# EAGLE design Smartenit_Board (EAGLE 8.6.0)
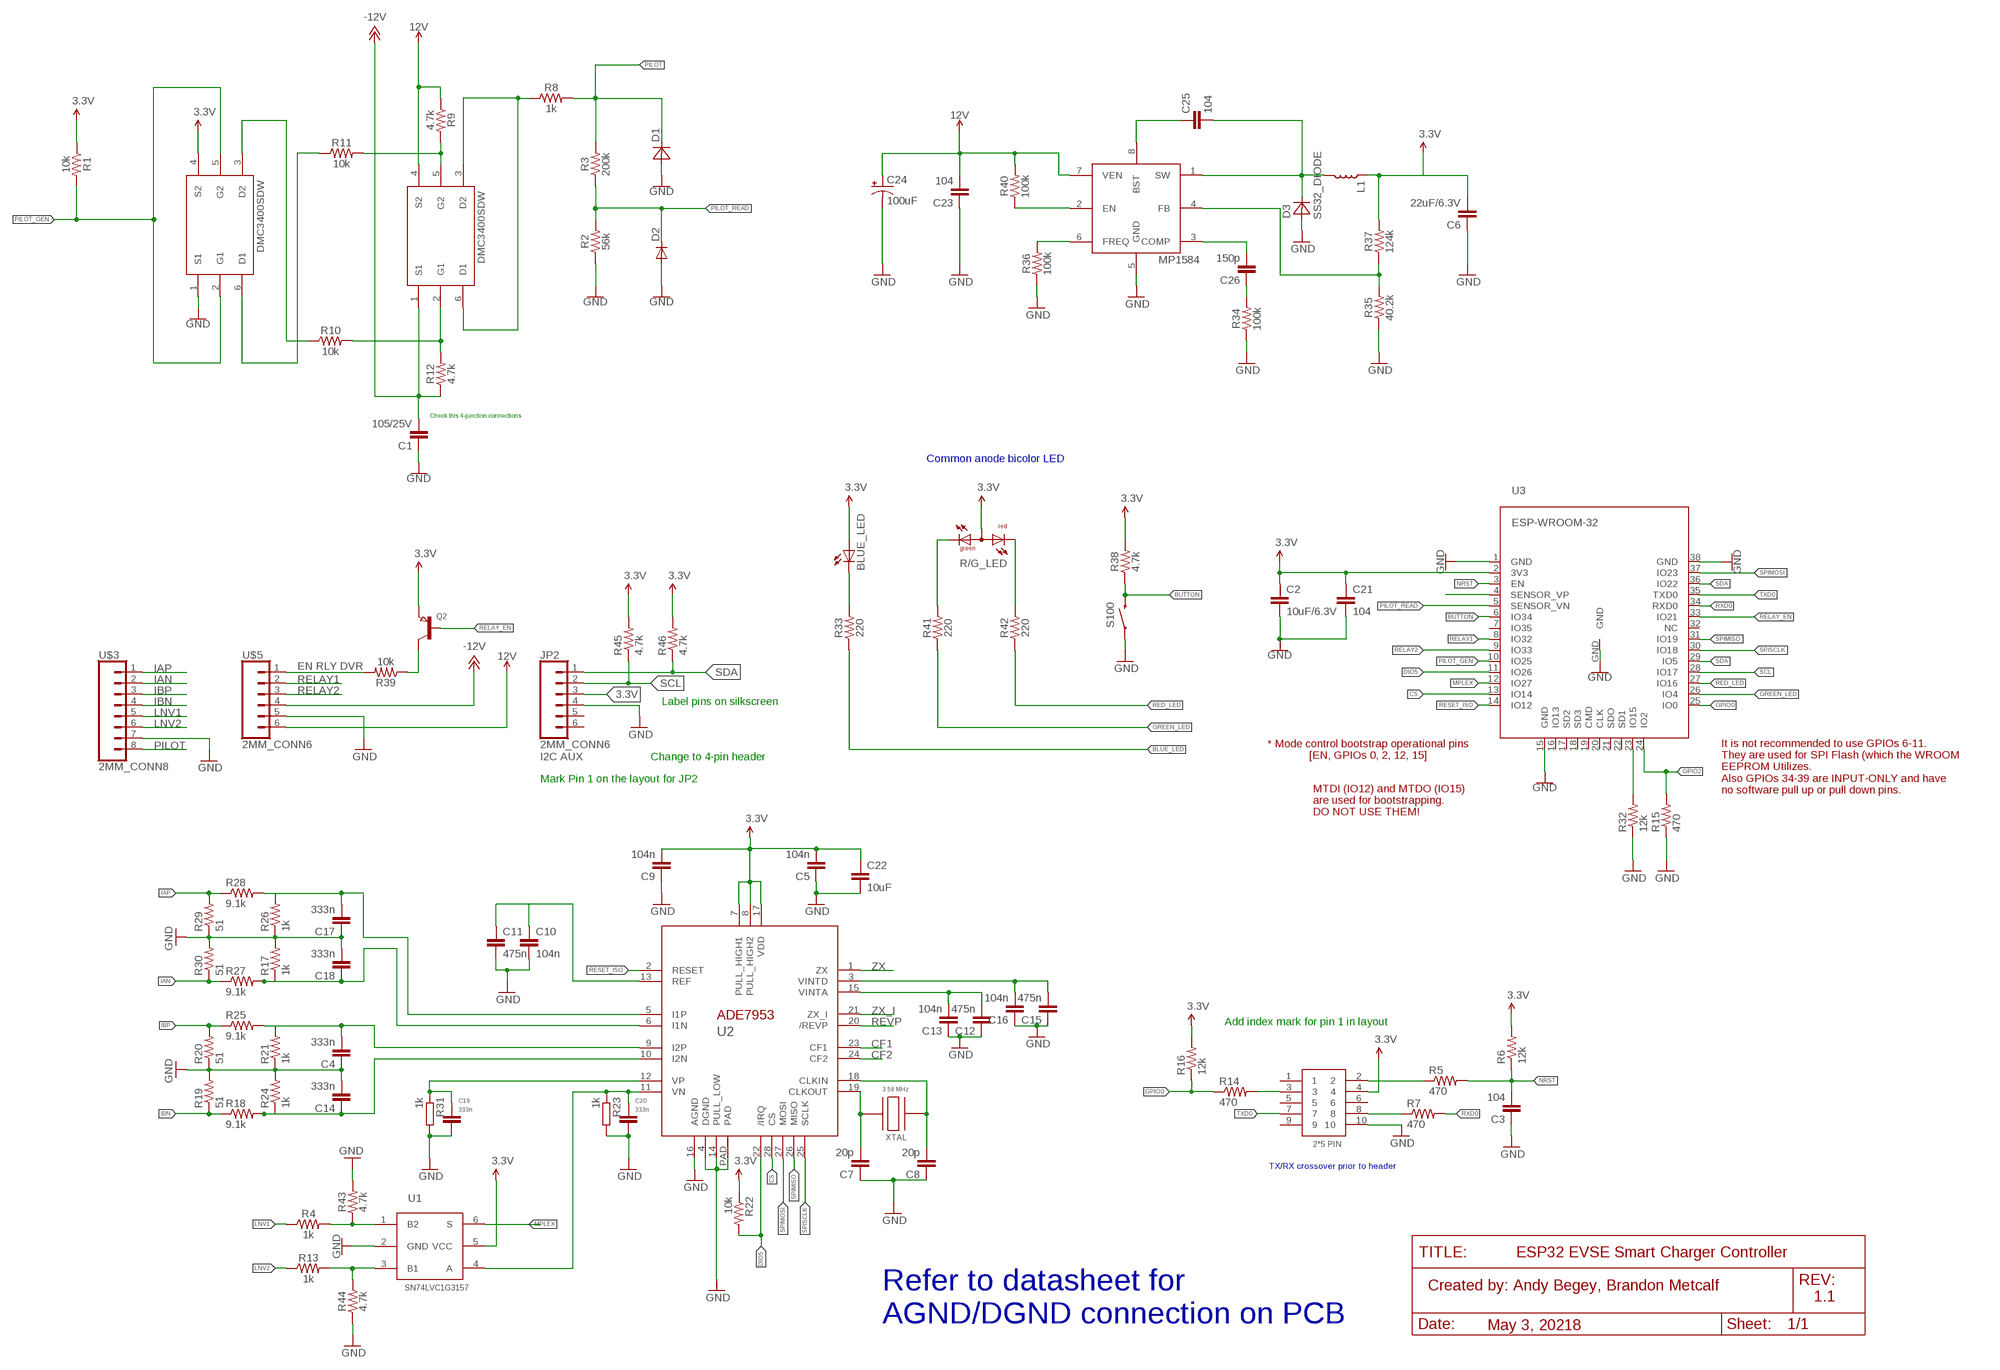
[diagram p0: schematic, sheet 1]

## Parts
BLUE_LED  LED3MM  [LED3MM]
C1  105/25V  680PF-0603-50V-10%  [0603]
C2  10uF/6.3V  CAP0805  [0805]
C3  104  0402-CAP  [0402-CAP]
C4  333n  0402-CAP  [0402-CAP]
C5  104n  0402-CAP  [0402-CAP]
C6  22uF/6.3V  680PF-0603-50V-10%  [0603]
C7  20p  0402-CAP  [0402-CAP]
C8  20p  0402-CAP  [0402-CAP]
C9  104n  0402-CAP  [0402-CAP]
C10  104n  0402-CAP  [0402-CAP]
C11  475n  0402-CAP  [0402-CAP]
C12  475n  0402-CAP  [0402-CAP]
C13  104n  0402-CAP  [0402-CAP]
C14  333n  0402-CAP  [0402-CAP]
C15  475n  0402-CAP  [0402-CAP]
C16  104n  0402-CAP  [0402-CAP]
C17  333n  0402-CAP  [0402-CAP]
C18  333n  0402-CAP  [0402-CAP]
C19  333n  C-EUC0805K  [C0805K]
C20  333n  C-EUC0805K  [C0805K]
C21  104  CAP0603-CAP  [0603-CAP]
C22  10uF  10UF-0805-10V-10%  [0805]
C23  104  680PF-0603-50V-10%  [0603]
C24  100uF  CAP_POLPTH1  [CPOL-RADIAL-100UF-25V]
C25  104  680PF-0603-50V-10%  [0603]
C26  150p  680PF-0603-50V-10%  [0603]
D1  P6SMB16A  TVSDIODE  [D014AC]
D2  DIODESOD  [SOD-323]
D3  SS32_DIODE  [D0-214AB]
J1  2X5CONNECTOR1.27MM  [1296-10]
JP2  2MM_CONN6  [CONN6_2MM]
L1  47µH/±30%/750mA  INDUCTOR-CR54-47UH  [CR54]
Q2  PNP-TRANSISTOR_SOT23  [SOT23]
R1  10k  100KOHM-0603-1/10W-1%  [0603]
R2  56k  100KOHM-0603-1/10W-1%  [0603]
R3  200k  100KOHM-0603-1/10W-1%  [0603]
R4  1k  1KOHM-0603-1/10W-1%  [0603]
R5  470  0402-RES  [0402-RES]
R6  12k  0402-RES  [0402-RES]
R7  470  0402-RES  [0402-RES]
R8  1k  100KOHM-0603-1/10W-1%  [0603]
R9  4.7k  100KOHM-0603-1/10W-1%  [0603]
R10  10k  100KOHM-0603-1/10W-1%  [0603]
R11  10k  100KOHM-0603-1/10W-1%  [0603]
R12  4.7k  100KOHM-0603-1/10W-1%  [0603]
R13  1k  1KOHM-0603-1/10W-1%  [0603]
R14  470  0402-RES  [0402-RES]
R15  470  0402-RES  [0402-RES]
R16  12k  0402-RES  [0402-RES]
R17  1k  0402-RES  [0402-RES]
R18  9.1k  0402-RES  [0402-RES]
R19  51  0402-RES  [0402-RES]
R20  51  0402-RES  [0402-RES]
R21  1k  0402-RES  [0402-RES]
R22  10k  0402-RES  [0402-RES]
R23  1k  R-EU_  [C0805K@1]
R24  1k  0402-RES  [0402-RES]
R25  9.1k  0402-RES  [0402-RES]
R26  1k  0402-RES  [0402-RES]
R27  9.1k  0402-RES  [0402-RES]
R28  9.1k  0402-RES  [0402-RES]
R29  51  0402-RES  [0402-RES]
R30  51  0402-RES  [0402-RES]
R31  1k  R-EU_  [C0805K@1]
R32  12k  0402-RES  [0402-RES]
R33  220  10KOHM-0603-1/10W-1%  [0603]
R34  100k  100KOHM-0603-1/10W-1%  [0603]
R35  40.2k  100KOHM-0603-1/10W-1%  [0603]
R36  100k  100KOHM-0603-1/10W-1%  [0603]
R37  124k  100KOHM-0603-1/10W-1%  [0603]
R38  4.7k  10KOHM-0603-1/10W-1%  [0603]
R39  10k  100KOHM-0603-1/10W-1%  [0603]
R40  100k  100KOHM-0603-1/10W-1%  [0603]
R41  220  10KOHM-0603-1/10W-1%  [0603]
R42  220  10KOHM-0603-1/10W-1%  [0603]
R43  4.7k  1KOHM-0603-1/10W-1%  [0603]
R44  4.7k  1KOHM-0603-1/10W-1%  [0603]
R45  4.7k  0402-RES  [0402-RES]
R46  4.7k  0402-RES  [0402-RES]
R/G_LED  DUOLED-RG-A  [DUOLED-A-5MM]
S100  SWITCH-MOMENTARY-2PTH  [TACTILE-PTH]
U1  SN74LVC1G3157  [DBV-6]
U2  ADE7953  [28-WFQFN]
U3  ESP-WROOM-32  [ESP-WROOM-32]
U$1  DMC3400SSDW  [SOT363]
U$2  DMC3400SSDW  [SOT363]
U$3  2MM_CONN8  [CONN82MM]
U$4  MP1584  [SOIC8]
U$5  2MM_CONN6  [CONN6_2MM]
XTAL  QUARTZ_3.58M_2PIN  [HC-49S]

## Nets
3.3V: BLUE_LED.A C2.1 C5.2 C6.2 C9.2 C21.1 C22.1 J1.4 JP2.3(PIN3) L1.P$1 Q2.2(E) R1.1 R6.2 R16.2 R22.1 R37.2 R38.2 R45.2 R46.2 R/G_LED.A U1.5(VCC) U2.7(PULL_HIGH1) U2.8(PULL_HIGH2) U2.17(VDD) U3.2(3V3) U$1.4(S2)
12V: C23.2 C24.1(+) R9.1 R40.2 U$2.4(S2) U$4.7(VEN) U$5.6(PIN6)
-12V: C1.2 R12.1 U$2.1(S1) U$5.4(PIN4)
AGND: C4.1 C10.2 C11.2 C12.1 C13.1 C14.2 C17.1 C18.2 C19.2 C20.2 R17.2 R19.2 R20.1 R21.1 R23.2 R24.2 R26.1 R29.1 R30.2 R31.2 U1.2(GND) U2.16(AGND) U$3.7 ; supply symbol labelled GND
BLUE_LED: R33.1
BUTTON: R38.1 S100.3 U3.6(IO34)
CF1: U2.23(CF1)
CF2: U2.24(CF2)
CS: U2.28(CS) U3.13(IO14)
DGND: C1.1 C2.2 C3.1 C5.1 C6.1 C7.1 C8.1 C9.1 C15.1 C16.1 C21.2 C22.2 C23.1 C24.2(-) D1.P D2.2(A) J1.10 R2.1 R15.1 R32.1 R34.1 R35.1 R36.1 R43.2 R44.1 S100.1 U2.4(DGND) U2.14(PULL_LOW) U2.PAD U3.1(GND) U3.15(GND) U3.38(GND) U3.GND U$1.1(S1) U$4.5(GND) U$5.5(PIN5) ; supply symbol labelled GND
DIO5: R22.2 U2.22(/IRQ) U3.11(IO26)
FRGGN: R32.2 U3.23(IO15)
GND: D3.P JP2.4(PIN4)
GPIO0: R14.1 R16.1 U3.25(IO0)
GPIO2: R15.2 U3.24(IO2)
GREEN_LED: R41.1 U3.26(IO4)
IAN: R27.1 R30.1 U$3.2
IAP: R28.1 R29.2 U$3.1
IBN: R18.1 R19.1 U$3.4
IBP: R20.2 R25.1 U$3.3
LNV1: R4.1 U$3.5
LNV2: R13.1 U$3.6
MPLEX: U1.6(S) U3.12(IO27)
N$1: C7.2 U2.19(CLKOUT) XTAL.1
N$2: C8.2 U2.18(CLKIN) XTAL.2
N$3 [ic]: C20.1 R23.1 U1.4(A) U2.11(VN)
N$4: R36.2 U$4.6(FREQ)
N$5: C4.2 R21.2 R25.2 U2.9(I2P)
N$7: C10.1 C11.1 U2.13(REF)
N$8: C12.2 C13.2 U2.15(VINTA)
N$10: R4.2 R43.1 U1.1(B2)
N$11: C14.1 R18.2 R24.1 U2.10(I2N)
N$12: C15.2 C16.2 U2.3(VINTD)
N$13: R13.2 R44.2 U1.3(B1)
N$14: R40.1 U$4.2(EN)
N$15: C26.2 U$4.3(COMP)
N$17: C26.1 R34.2
N$18: C25.2 D3.N L1.P$2 U$4.1(SW)
N$19: R35.2 R37.1 U$4.4(FB)
N$20: Q2.3(C) R39.1
N$21: BLUE_LED.K(C) R33.2
N$22: C25.1 U$4.8(BST)
N$23: R9.2 R11.2 U$2.5(G2)
N$24: C17.2 R26.2 R28.2 U2.5(I1P)
N$25: R41.2 R/G_LED.CX(CG)
N$26: R42.2 R/G_LED.CR
N$27: C18.1 R17.1 R27.2 U2.6(I1N)
N$28: R10.1 U$1.3(D2)
N$29: R10.2 R12.2 U$2.2(G1)
N$32: R11.1 U$1.6(D1)
N$33: R8.1 U$2.3(D2) U$2.6(D1)
N$38: R39.2 U$5.1(PIN1)
N$40: J1.3 R14.2
N$47: U3.4(SENSOR_VP)
N$62: J1.2 R5.1
N$65: J1.8 R7.1
NRST: C3.2 R5.2 R6.1 U3.3(EN)
PILOT: D1.N R3.2 R8.2 U$3.8
PILOT_GEN: R1.2 U3.10(IO25) U$1.2(G1) U$1.5(G2)
PILOT_READ: D2.1(C) R2.2 R3.1 U3.5(SENSOR_VN)
RED_LED: R42.1 U3.27(IO16)
RELAY1: U3.8(IO32) U$5.2(PIN2)
RELAY2: U3.9(IO33) U$5.3(PIN3)
RELAY_EN: Q2.1(B) U3.33(IO21)
RESET_ISO: U2.2(RESET) U3.14(IO12)
REVP: U2.20(/REVP)
RXD0: R7.2 U3.34(RXD0)
SCL: JP2.2(PIN2) R45.1 U3.28(IO17)
SDA: JP2.1(PIN1) R46.1 U3.29(IO5) U3.36(IO22)
SPIMISO: U2.26(MISO) U3.31(IO19)
SPIMOSI: U2.27(MOSI) U3.37(IO23)
SPISCLK: U2.25(SCLK) U3.30(IO18)
TXD0: J1.7 U3.35(TXD0)
V2P [ic]: C19.1 R31.1 U2.12(VP)
ZX: U2.1(ZX)
ZX_I: U2.21(ZX_I)
Unconnected: J1.1 J1.5 J1.6 J1.9 JP2.5(PIN5) JP2.6(PIN6) U3.7(IO35) U3.16(IO13) U3.17(SD2) U3.18(SD3) U3.19(CMD) U3.20(CLK) U3.21(SDO) U3.22(SD1) U3.32(NC)

## Notes on the sheet
- Check this 4-junction connections
- Common anode bicolor LED
- Q2
- EN RLY DVR
- Label pins on silkscreen
- * Mode control bootstrap operational pins
  [EN, GPIOs 0, 2, 12, 15]
- I2C AUX | Change to 4-pin header
- Mark Pin 1 on the layout for JP2
- It is not recommended to use GPIOs 6-11.
  They are used for SPI Flash (which the WROOM
  EEPROM Utilizes.
  Also GPIOs 34-39 are INPUT-ONLY and have
  no software pull up or pull down pins.
- MTDI (IO12) and MTDO (IO15) 
  are used for bootstrapping. 
  DO NOT USE THEM!
- Add index mark for pin 1 in layout
- 3.58 MHz
- TX/RX crossover prior to header
- ESP32 EVSE Smart Charger Controller
- Created by: Andy Begey, Brandon Metcalf
- 1.1
- Refer to datasheet for 
  AGND/DGND connection on PCB
- May 3, 20218

## Library data of the parts
BLUE_LED = SparkFun:LED: LEDs Standard schematic elements and footprints for 5mm, 3mm, 1206, and 0603 sized LEDs. 5mm - Spark Fun Electronics SKU : COM-00529 (and others)
C1 C6 C23 C25 C26 = SparkFun-Capacitors:680PF: 680pF/0.68nF ceramic capacitors A capacitor is a passive two-terminal electrical component used to store electrical energy temporarily in an electric field.; PROD_ID: CAP-09232; VALUE: 680pF
C2 C21 = SparkFun:CAP: Capacitor Standard 0603 ceramic capacitor, and 0.1" leaded capacitor.
C3-C5 C7-C18 = Nizanlib:0402-CAP
C19 C20 = resistor:C-EU: CAPACITOR, European symbol
C22 = SparkFun-Capacitors:10UF: 10.0µF ceramic capacitors A capacitor is a passive two-terminal electrical component used to store electrical energy temporarily in an electric field.; PROD_ID: CAP-11330
C24 = SparkFun:CAP_POL: Capacitor Polarized These are standard SMD and PTH capacitors. Normally 10uF, 47uF, and 100uF in electrolytic and tantalum varieties. Always verify the external diameter of the through hole cap, it varies with capacity, voltage, and manufacturer. The EIA devices should be standard.
D1 = Smart_Charger:TVSDIODE
D2 = SparkFun:DIODE: Diode These are standard reverse protection diodes and small signal diodes. SMA package can handle up to about 1A. SOD-323 can handle about 200mA. What the SOD-323 package when ordering, there are some mfgs out there that are 5-pin packages.
D3 = Smart_Charger:SS32_DIODE
J1 = Smart_Charger:2X5CONNECTOR1.27MM
JP2 U$5 = Smart_Charger:2MM_CONN6
L1 = SparkFun-Coils:INDUCTOR: Inductors Resist changes in electrical current. Basically a coil of wire. SparkFun Products: SparkFun Load Cell Amplifier - HX711 <https://www.sparkfun.com/products/13879> IOIO-OTG - V2.2 <https://www.sparkfun.com/products/13613>; PROD_ID: NDUC-10789
Q2 = semicon-smd-ipc:PNP-TRANSISTOR_: PNP TRANSISTOR
R1-R3 R8-R12 R35 R37 R39 = SparkFun-Resistors:100KOHM: 100kΩ resistor A resistor is a passive two-terminal electrical component that implements electrical resistance as a circuit element. Resistors act to reduce current flow, and, at the same time, act to lower voltage levels within circuits. - Wikipedia; PROD_ID: RES-07828; VALUE: 100k
R4 R13 = SparkFun-Resistors:1KOHM: 1kΩ resistor A resistor is a passive two-terminal electrical component that implements electrical resistance as a circuit element. Resistors act to reduce current flow, and, at the same time, act to lower voltage levels within circuits. - Wikipedia; PROD_ID: RES-07856
R5-R7 R14-R22 R24-R30 R32 R45 R46 = Nizanlib:0402-RES
R23 R31 = resistor:R-EU_: RESISTOR, European symbol
R33 R38 R41 R42 = SparkFun-Resistors:10KOHM: 10kΩ resistor A resistor is a passive two-terminal electrical component that implements electrical resistance as a circuit element. Resistors act to reduce current flow, and, at the same time, act to lower voltage levels within circuits. - Wikipedia; PROD_ID: RES-00824; VALUE: 10k
R34 R36 R40 = SparkFun-Resistors:100KOHM: 100kΩ resistor A resistor is a passive two-terminal electrical component that implements electrical resistance as a circuit element. Resistors act to reduce current flow, and, at the same time, act to lower voltage levels within circuits. - Wikipedia; PROD_ID: RES-07828
R43 R44 = SparkFun-Resistors:1KOHM: 1kΩ resistor A resistor is a passive two-terminal electrical component that implements electrical resistance as a circuit element. Resistors act to reduce current flow, and, at the same time, act to lower voltage levels within circuits. - Wikipedia; PROD_ID: RES-07856; VALUE: 1k
R/G_LED = led:DUOLED-RG-A: DUO LED 2 colors (red/green), 5 mm, round, common Anode www.ligitek.com or other producers.
S100 = SparkFun:SWITCH-MOMENTARY-2
U1 = Smart_Charger:SN74LVC1G3157
U2 = CalPlug:ADE7953
U3 = esp32:ESP-WROOM-32
U$1 U$2 = Smart_Charger:DMC3400SSDW
U$3 = Smart_Charger:2MM_CONN8
U$4 = Smart_Charger:MP1584
XTAL = CalPlug:QUARTZ_3.58M_2PIN; DIGIKEY: http://www.digikey.com/product-detail/en/txc-corporation/9C-3.579545MBBK-T/887-2450-1-ND/4475440

## Net classes
1 HIGHVOLTAGE: width 0.254 mm, drill 0.508 mm, clearance 2.413 mm to class 0, clearance 0.152 mm
2 ic: width 0.152 mm, drill 0.305 mm, clearance 0.205 mm to class 0, clearance 2.413 mm to class 1, clearance 0.205 mm

## Board
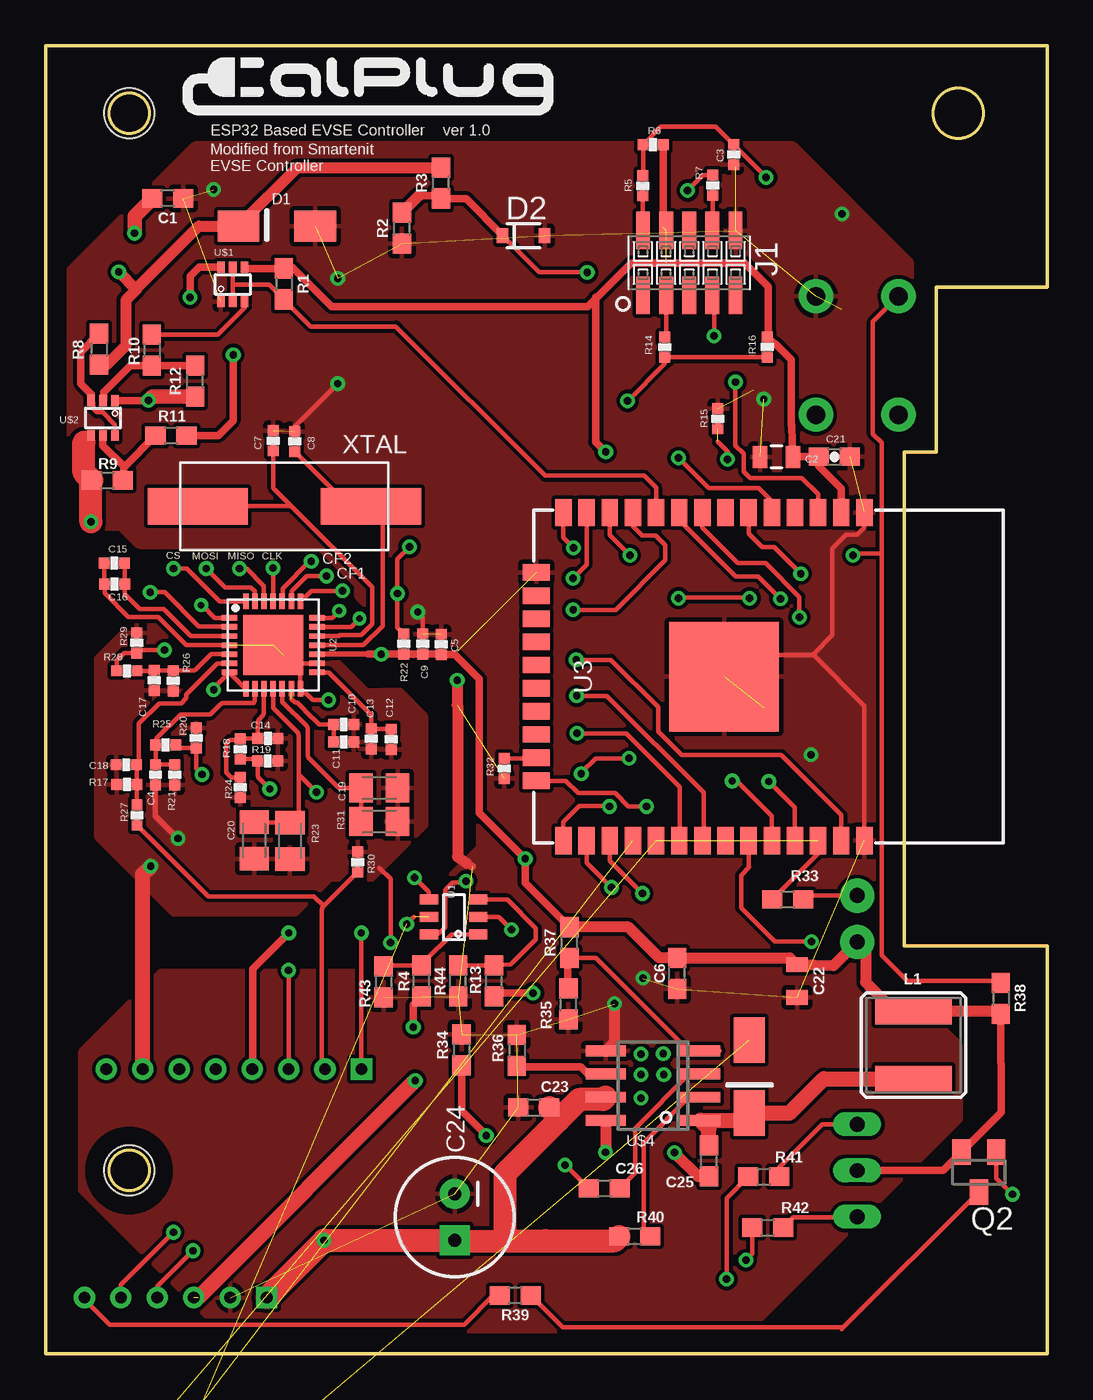
[diagram p1: board, top side]
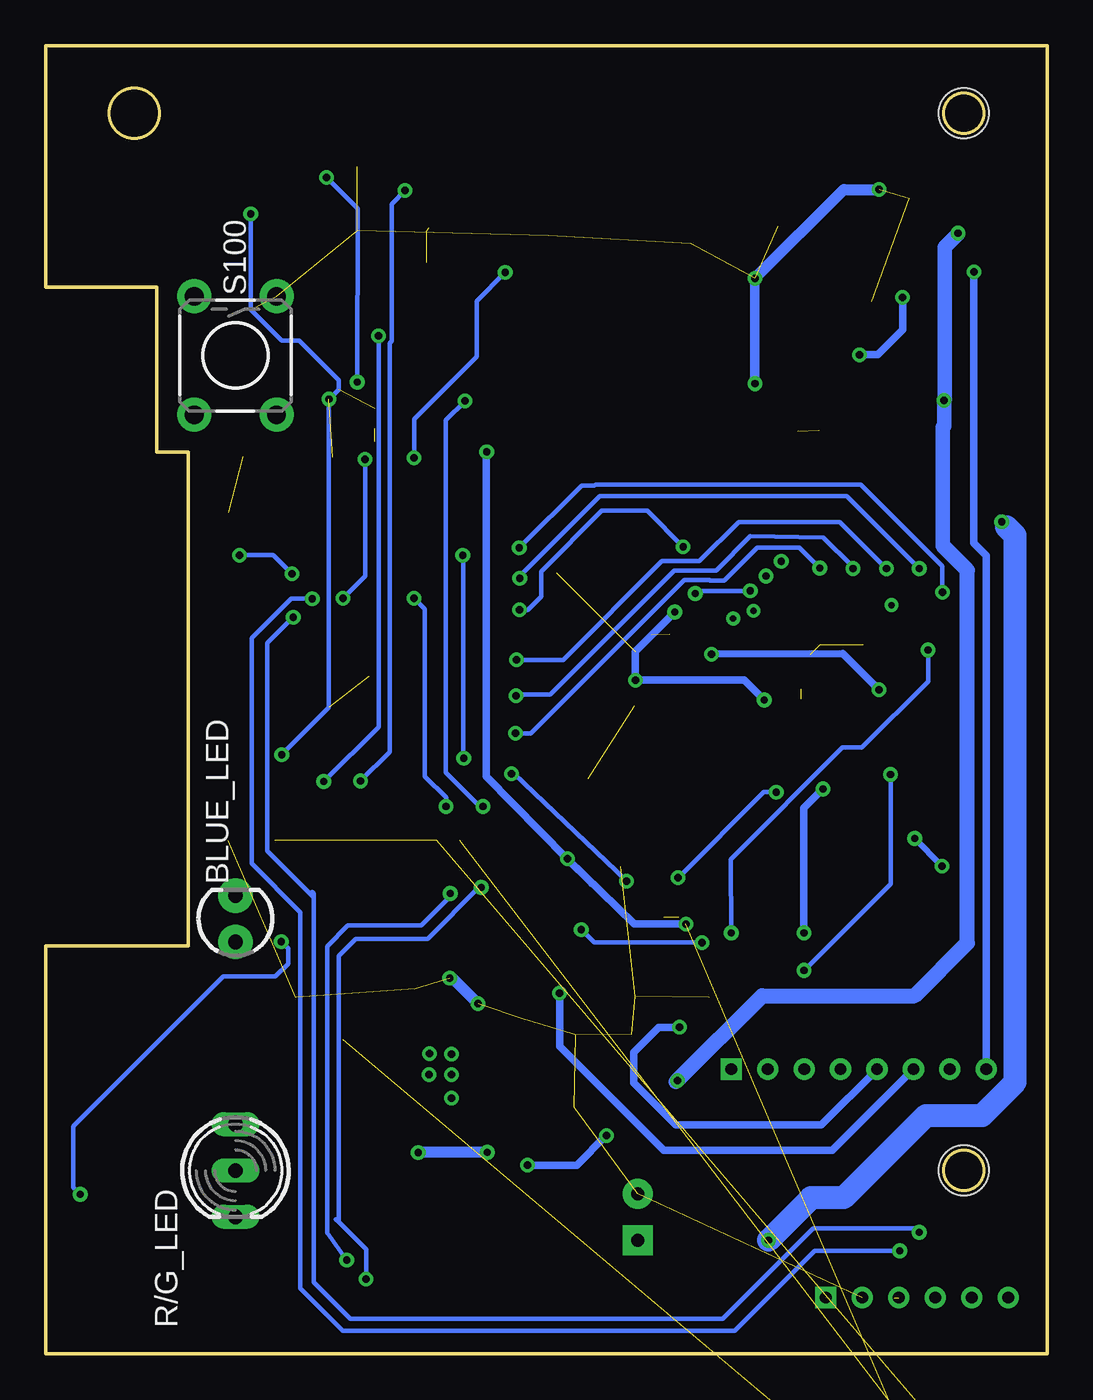
[diagram p2: board, bottom side, seen from below]

Size 54.94 x 71.8 mm. Coordinates in mm from the lower left corner, seen from the top.
Outline: 0,71.8 0,0 54.94,0 54.94,22.39 47.1,22.39 47.1,49.5 48.85,49.5 48.85,58.54 54.94,58.54 54.94,71.8 0,71.8
Outline: circle at 4.58,68.08 radius 1.1
Outline: circle at 50.07,68.08 radius 1.38
Outline: circle at 4.58,10.07 radius 1.1
Copper layers (1*16): Top 0.035mm / dielectric 1.5mm / Bottom 0.035mm
Design rules "default *": minimum track width 10mil, minimum drill 15mil, track to track 8mil, track to pad 8mil, pad to pad 8mil, via to via 8mil, smd to smd 8mil, copper to edge 40mil, drill to drill 8mil, minimum pad ring 10mil, minimum via ring 8mil, stop-mask expansion 4mil, vias tented up to drill 0mil, thermal gap 10mil
Holes 2.75 mm at 4.58,68.08 50.07,68.08 4.58,10.07

### Footprints (pad centres in the part's own frame; a part is rotated, then mirrored left to right if it is on the bottom)
LED3MM = drill 0.813 pad 1.88: A -1.27,0; K 1.27,0
0603 = smd 1.1 x 1: 1 -0.85,0; 2 0.85,0
0805 = smd 0.8 x 1.2: 1 -0.9,0; 2 0.9,0
0402-CAP = smd 0.6 x 0.6: 1 -0.55,0; 2 0.55,0
C0805K = smd 1.3 x 1.6: 1 -1,0; 2 1,0
0603-CAP = smd 1.1 x 1: 1 -0.85,0; 2 0.85,0
CPOL-RADIAL-100UF-25V = drill 0.7 pad 1.651 square: 1 1.27,0 | drill 0.7 pad 1.651: 2 -1.27,0
D014AC = smd 2.3 x 1.7: N 4.2,0; P 0,0
SOD-323 = smd 0.63 x 0.83: 1 -1.15,0; 2 1.15,0
D0-214AB = smd 2.5 x 1.7: N 4,0; P 0,0
1296-10 = smd 0.76 x 2.05: 1 -2.54,-1.78; 2 -2.54,1.78; 3 -1.27,-1.78; 4 -1.27,1.78; 5 0,-1.78; 6 0,1.78; 7 1.27,-1.78; 8 1.27,1.78; 9 2.54,-1.78; 10 2.54,1.78
CONN6_2MM = drill 0.65: 1 0,0; 2 2,0; 3 4,0; 4 6,0; 5 8,0 | drill 0.65 square: 6 10,0
CR54 = smd 4.2 x 1.4: P$1 0,1.85; P$2 0,-1.85
SOT23 = smd 1 x 1.4: 1 -0.95,-1.1; 2 0.95,-1.1; 3 0,1.1
0402-RES = smd 0.6 x 0.6: 1 -0.55,0; 2 0.55,0
C0805K@1 = smd 1.3 x 1.6: 1 -1,0; 2 1,0
DUOLED-A-5MM = drill 0.813 long: A 0,0; CR 2.54,0; CX -2.54,0
TACTILE-PTH = drill 1.016 pad 1.88: 1 -3.251,2.261; 2 3.251,2.261; 3 -3.251,-2.261; 4 3.251,-2.261
DBV-6 = smd 0.55 x 1: 1 0,0; 2 0.95,0; 3 1.9,0; 4 1.9,2.7; 5 0.95,2.7; 6 0,2.7
28-WFQFN = smd 0.85 x 0.3: 1 -2.4,1.5; 2 -2.4,1; 3 -2.4,0.5; 4 -2.4,0; 5 -2.4,-0.5; 6 -2.4,-1; 7 -2.4,-1.5; 15 2.4,-1.5; 16 2.4,-1; 17 2.4,-0.5; 18 2.4,0; 19 2.4,0.5; 20 2.4,1; 21 2.4,1.5 | smd 0.3 x 0.85: 8 -1.5,-2.4; 9 -1,-2.4; 10 -0.5,-2.4; 11 0,-2.4; 12 0.5,-2.4; 13 1,-2.4; 14 1.5,-2.4; 22 1.5,2.4; 23 1,2.4; 24 0.5,2.4; 25 0,2.4; 26 -0.5,2.4; 27 -1,2.4; 28 -1.5,2.4 | smd 3.3 x 3.3: PAD 0,0
ESP-WROOM-32 = smd 0.9 x 1.5: 1 7.7,9; 2 6.43,9; 3 5.16,9; 4 3.89,9; 5 2.62,9; 6 1.35,9; 7 0.08,9; 8 -1.19,9; 9 -2.46,9; 10 -3.73,9; 11 -5,9; 12 -6.27,9; 13 -7.54,9; 14 -8.81,9; 25 -8.81,-9; 26 -7.54,-9; 27 -6.27,-9; 28 -5,-9; 29 -3.73,-9; 30 -2.46,-9; 31 -1.19,-9; 32 0.08,-9; 33 1.35,-9; 34 2.62,-9; 35 3.89,-9; 36 5.16,-9; 37 6.43,-9; 38 7.7,-9 | smd 1.5 x 0.9: 15 -10.3,5.715; 16 -10.3,4.445; 17 -10.3,3.175; 18 -10.3,1.905; 19 -10.3,0.635; 20 -10.3,-0.635; 21 -10.3,-1.905; 22 -10.3,-3.175; 23 -10.3,-4.445; 24 -10.3,-5.715 | smd 6 x 6: GND 0,0
SOT363 = smd 0.42 x 0.6: 1 0,0; 2 0.65,0; 3 1.3,0; 4 1.3,1.9; 5 0.65,1.9; 6 0,1.9
CONN82MM = drill 0.65 square: 1 14,0 | drill 0.65: 2 12,0; 3 10,0; 4 8,0; 5 6,0; 6 4,0; 7 2,0; 8 0,0
SOIC8 = smd 0.6 x 2.2: 1 -1.905,-2.6; 2 -0.635,-2.6; 3 0.635,-2.6; 4 1.905,-2.6; 5 1.905,2.6; 6 0.635,2.6; 7 -0.635,2.6; 8 -1.905,2.6
HC-49S = smd 5.5 x 2: 1 -4.75,0; 2 4.75,0

### Placement (x,y rotation side)
BLUE_LED  44.52,23.88 90 bottom
C1  6.7,63.41 180 top
C2  40.09,49.23 180 top
C3  37.74,65.82 90 top
C4  6.03,31.78 90 top
C5  21.7,38.94 270 top
C6  34.65,20.89 90 top
C7  12.49,50.12 270 top
C8  13.67,50.08 270 top
C9  20.69,38.96 270 top
C10  16.36,34.55 0 top
C11  16.36,33.58 0 top
C12  18.97,33.73 90 top
C13  17.87,33.75 90 top
C14  12.19,33.78 0 top
C15  3.77,43.41 0 top
C16  3.78,42.26 0 top
C17  5.96,36.96 90 top
C18  4.42,32.33 180 top
C19  18.31,31.06 0 top
C20  11.45,28.17 270 top
C21  43.27,49.24 0 top
C22  41.22,20.47 270 top
C23  26.79,13.53 0 top
C24  22.45,7.51 270 top
C25  36.39,10.59 90 top
C26  30.66,9.09 0 top
D1  14.78,61.89 180 top
D2  26.22,61.37 0 top
D3  38.61,17.23 270 top
J1  35.31,59.87 0 top
JP2  2.13,-8.49 0 top  (outside the outline)
L1  47.62,16.95 0 top
Q2  51.2,9.98 180 top
R1  13.07,58.72 270 top
R2  19.55,61.77 90 top
R3  21.69,64.26 90 top
R4  20.62,20.47 90 top
R5  32.75,64.1 90 top
R6  33.33,66.37 0 top
R7  36.61,64.13 90 top
R8  2.93,55.13 270 top
R9  3.39,47.94 0 top
R10  5.82,55.08 270 top
R11  6.88,50.4 180 top
R12  8.21,53.38 90 top
R13  24.6,20.47 90 top
R14  33.97,55.25 90 top
R15  36.88,51.32 270 top
R16  39.6,55.26 90 top
R17  4.46,31.25 180 top
R18  10.68,33.19 90 top
R19  12.19,32.54 0 top
R20  8.26,33.8 270 top
R21  7.09,31.79 90 top
R22  19.66,38.97 90 top
R23  13.41,28.15 270 top
R24  10.68,31.09 270 top
R25  6.59,33.41 180 top
R26  7.01,36.94 90 top
R27  5.02,29.57 90 top
R28  4.46,37.49 0 top
R29  4.99,39.02 270 top
R30  17.11,27 90 top
R31  18.31,29.22 0 top
R32  25.17,32.13 90 top
R33  40.7,24.94 0 top
R34  22.82,16.68 270 top
R35  28.68,19.2 90 top
R36  25.85,16.65 270 top
R37  28.74,22.57 90 top
R38  52.39,19.52 270 top
R39  25.76,3.21 180 top
R40  32.31,6.45 180 top
R41  39.41,9.74 0 top
R42  39.61,6.94 0 top
R43  18.54,20.42 270 top
R44  22.63,20.47 90 top
R45  -2.06,-15.58 0 top  (outside the outline)
R46  -2.06,-18.52 0 top  (outside the outline)
R/G_LED  44.52,10.07 270 bottom
S100  44.52,54.79 270 bottom
U1  23.73,23.03 90 top
U2  12.48,38.9 0 top
U3  37.22,37.17 0 top
U$1  9.62,57.74 0 top
U$2  3.8,52.31 180 top
U$3  3.33,15.63 0 top
U$4  33.32,14.73 90 top
U$5  2.13,3.09 0 top
XTAL  13.1,46.53 0 top

### Tracks (layer width: path | path; a pad name or v marks a point on that pad's centre or on a via)
3.3V  (via drill 0.4)  (6 unrouted)
  Top 0.254: U2.8 U2.7 9.29,36.6 arc45 v9.22,36.44 | 15.46,38.4 U2.17 | 20.2,23.98 v19.81,23.59
  Top 0.305: v18.42,38.4 17.65,38.4 15.46,38.4
  Top 0.406: R6.2 33.88,61.81 | 34.04,59.88 34.05,59.87 | 34.05,59.87 32.14,59.87 30.18,57.91 | U$1.4 10.99,59.57 R1.1 13.11,59.61 13.56,59.61 15.7,57.47 29.74,57.47 30.18,57.91 | 30.18,57.91 30.18,57.99 | R38.2 52.42,13.25 Q2.2 49.24,10.07 R/G_LED.A | C9.2 20.21,38.39 | 34.05,59.87 38.35,59.87 39.65,58.57 39.65,55.86 R16.2 39.99,55.42 40.07,55.42 40.92,54.57 40.92,50.98 40.94,50.96 C2.1 40.95,49.24 C21.1 42.42,48.71 43.65,47.48 U3.2 | 17.71,38.4 v18.42,38.4 19.64,38.4 R22.1 C9.2 | 30.18,57.91 30.18,50.05 v30.73,49.5 | R37.2 26.31,25.85 v26.31,27.18 23.8,29.69 23.8,37.03 22.44,38.39 C5.2 21.68,38.41 C9.2
  Top 0.61: R38.2 52.27,18.8 L1.P$1 46.58,18.8 44.98,20.39 44.98,22.15 BLUE_LED.A 43.23,21.32 C22.1 40.8,21.74 C6.2 33.65,21.74 31.97,23.42 R37.2
  Bottom 0.406: 24.97,25.85 24.97,25.86 | 24.97,25.83 24.97,25.85 | 24.97,25.85 v26.31,27.18 | v26.31,27.18 30.76,31.7 30.76,49.47 v30.73,49.5 | v9.22,36.44 11.2,38.42 v18.42,38.4 | v26.31,27.18 22.65,23.59 v19.81,23.59
12V  (via drill 0.4)  (1 unrouted)
  Top 0.406: R9.1 2.52,47.96 2.5,47.98 U$2.4
  Top 0.61: v2.49,45.66 2.54,45.71
  Top 1.27: 25.2,6.2 22.52,6.17 C24.1 v15.28,6.24 U$5.6 | 25.2,6.2 27.41,6.22 31.23,6.22 R40.2 | U$4.7 30.59,13.96 29.27,13.96 28.12,12.81 | v2.49,45.66 2.49,47.92 2.52,47.96 | R9.1 2.5,47.98 2.1,48.38 2.1,50.03 | 28.12,12.81 25.2,9.89 25.2,6.2 | 28.12,12.81 28.12,13.04 C23.2
  Bottom 0.813: v2.49,45.66 1.75,44.92
  Bottom 1.27: 2.23,45.4 1.75,44.92 1.75,14.9 3.56,13.09 6.64,13.09 11.16,8.57 12.95,8.57 v15.28,6.24
-12V  (via drill 0.4)  (1 unrouted)
  Top 0.406: U$2.1 5.63,52.31
  Top 0.61: 5.85,52.53 v5.65,52.33
  Top 0.8: R12.1 5.85,52.53 5.63,52.31 | v4.88,61.5 4.88,62.44 C1.2
  Top 0.813: v20.28,15 8.37,3.09
  Bottom 0.8: 20.38,14.92 20.36,14.92 v20.28,15 | 5.71,44.35 5.71,50.87 5.65,50.93 v5.65,52.33 5.62,52.36 5.62,60.73 4.88,61.47 v4.88,61.5
  Bottom 0.813: v20.28,15 15.63,19.65 7.26,19.65 4.37,22.55 4.37,43.01 5.71,44.35
AGND  (via drill 0.4)
  Top 0.254: v18.92,22.57 18.92,26.05 18.31,26.66 | U2.16 13.48,37.9 | U1.2 24.86,23.98 v25.55,23.29
  Top 0.305: C4.1 6.03,29.52 v7.26,28.29
  Top 0.813: U$3.7 5.33,26.33 v5.77,26.77
  Bottom 0.254: v25.55,23.29 24.84,22.57 v18.92,22.57
  Bottom 0.305: v7.26,28.29 5.77,26.79 v5.77,26.77
  pour Top: 9.34,42.49 7.17,42.49 arc45 6.99,42.41 2.77,38.2 2.77,28.47 arc45 2.84,28.29 7.01,24.12 13.64,24.12 arc45 13.82,24.2 15.65,26.03 17.8,26.03 arc45 17.98,26.1 20.88,29 20.88,34.92 arc45 20.8,35.1 19.51,36.39 arc45 19.33,36.47 17.65,36.42 11.71,42.36 arc45
BLUE_LED
  Top 0.254: R33.1 42.38,27.47
BUTTON  (via drill 0.4)
  Top 0.254: R38.1 52.3,20.47 47.27,20.47 45.86,21.87 45.86,43.91 | 45.86,43.91 45.86,50.01 45.39,50.48 45.39,56.65 S100.3 | 45.86,43.91 44.37,43.91 v44.3,43.83 | v41.43,42.82 39.98,44.27 39.32,44.27 38.57,45.02 U3.6
  Bottom 0.254: v44.3,43.83 42.44,43.83 v41.43,42.82
CF1  (via drill 0.4)
  Top 0.254: U2.23 13.5,41.32 13.5,41.86 14.34,42.69 v15.42,42.69
CF2  (via drill 0.4)
  Top 0.254: U2.24 13,41.32 13,42 14.5,43.5 v14.58,43.5
CS  (via drill 0.4)
  Top 0.254: v28.93,42.56 29.68,43.31 U3.13 | U2.28 9.55,41.3 7.75,43.1 v7.01,43.1
  Bottom 0.254: v28.93,42.56 28.93,42.69 24.54,47.09 11,47.09 v7.01,43.1
DGND  (via drill 0.4)  (31 unrouted)
  Top 0.254: 42.1,38.39 42.06,38.35 38.4,38.35 U3.GND | U3.38 44.92,35.57 42.1,38.39 | C3.1 37.85,65.16 | C8.1 13.67,50.88 v16.03,53.25 | U2.4 7.71,38.9 6.17,40.43 4.55,40.43 3.23,41.74 C16.1 3.22,42.27 C15.1 | 13.03,38.35 13.03,37.71 13.34,37.4 13.98,37.4 U2.14 14.04,36.5 14.65,35.88 v15.52,35.88 | 42.1,38.39 43.15,39.44 43.15,44.19 43.92,44.95 44.53,44.95 44.92,45.35 U3.1 | v20.42,40.71 20.69,40.44 C9.1
  Top 0.406: 23.1,26.94 23.4,26.76
  Top 0.61: U$4.5 31.22,17.13 v31.22,19.22 | v22.58,36.98 22.58,35.6 22.61,35.58 22.61,27.27 23.1,26.94
  Bottom 0.254: v43.69,62.55 43.69,57.3 41.99,55.59 41.02,55.59 38.86,53.44 38.86,52.93 v39.4,52.39 39.4,35.48 v41.99,32.89
  Bottom 0.406: v15.52,35.88 16.61,36.98 v22.58,36.98 22.58,38.55 v20.42,40.71
  Bottom 0.508: v16.03,59.02 v16.03,53.25
  Bottom 0.61: v16.03,59.02 11.15,63.9 v9.22,63.9 | v31.22,19.22 32.61,20.62 v32.77,20.62
  pour Top: 4.06,45.31 4.99,44.38 arc45 5.21,44.29 14.78,44.29 arc-45 15,44.2 17.04,42.16 17.04,41.68 arc45 17.14,41.46 19.59,39 arc45 19.82,38.91 22.33,38.91 23.66,37.58 arc-45 23.75,37.35 23.75,27.96 arc-45 23.66,27.74 17.03,21.12 arc-45 16.81,21.03 6.3,21.03 2,16.72 arc45 1.9,16.5 1.9,8.96 10.19,0.67 arc45 10.42,0.58 37.79,0.58 arc45 38.02,0.67 50.19,12.85 50.19,16.88 arc45 50.1,17.11 45.62,21.58 45.62,48.76 arc-45 45.71,48.98 47.52,50.79 47.52,59.81 arc45 47.43,60.03 41.11,66.35 arc45 40.89,66.44 8.31,66.44 arc45 8.09,66.35 0.88,59.14 arc45 0.79,58.92 0.76,48.53 arc45 1.8,45.82 3.06,45.21 arc-45 3.28,45.31
DIO5  (via drill 0.4)
  Top 0.254: 14.08,41.4 U2.22 14.56,41.88 v16.28,41.88 | v28.94,40.83 31.26,40.83 33.99,43.55 33.99,44.39 33.48,44.9 32.74,44.9 32.22,45.42 U3.11 | v19.96,44.29 19.3,43.63 v19.3,41.73 19.3,39.87 R22.2
  Bottom 0.254: v28.94,40.83 28.5,40.83 27.76,41.57 27.76,42.95 24.44,46.27 21.95,46.27 v19.96,44.29 | v19.3,41.73 19.15,41.88 v16.28,41.88
FRGGN
  Top 0.254: R32.2 26.88,32.68 U3.23
GND  (1 unrouted)
GPIO0  (via drill 0.4)
  Top 0.254: v31.93,52.3 33.97,54.34 R14.1 R16.1 | U3.25 28.41,29.19 29.29,30.07 30.91,30.07 v30.94,30.04
  Bottom 0.254: v31.93,52.3 32.98,51.25 32.98,33.46 | 32.99,33.45 32.98,33.46 | v30.94,30.04 31.12,30.04 32.99,31.92 32.98,31.94 32.98,33.46
GPIO2  (via drill 0.4)  (1 unrouted)
  Top 0.254: 27.32,31.45 U3.24 28.53,31.45 29.21,30.78 31.24,30.78 31.97,30.04 v32.97,30.04 | v38.62,41.47 38.59,41.5 34.75,41.5 v34.72,41.47 | 36.88,50.06 37.41,49.53 v37.41,49.09
  Bottom 0.254: v38.62,41.47 37.41,42.68 v37.41,49.09 | v34.72,41.47 34.14,40.89 34.14,31.69 32.97,30.52 v32.97,30.04
GREEN_LED  (via drill 0.4)
  Top 0.254: R41.1 37.36,8.54 v37.36,4.1 | v31.04,25.6 29.68,26.96 U3.26
  Bottom 0.254: v37.36,4.1 37.36,5.74 38.87,7.25 | 38.87,7.25 39.02,7.4 | 38.87,7.25 38.87,21.83 37.92,22.78 33.99,22.78 31.17,25.6 v31.04,25.6
IAN
  Top 0.254: U$3.2 15.16,15.8 15.16,24.36 arc-45 15.25,24.58 | R30.1 15.25,24.58 | 15.25,24.58 14.72,25.11 8.93,25.11 R27.1
IAP  (via drill 0.4)
  Top 0.254: 17.21,15.75 U$3.1 17.33,21.06 v17.32,23.11 | R28.1 3.91,38.07 4.32,38.47 R29.2 5.15,38.63 v6.53,38.63
  Bottom 0.254: v17.32,23.11 17.35,27.15 11.23,33.27 10.16,33.27 6.53,36.9 v6.53,38.63
IBN  (via drill 0.4)
  Top 0.254: R18.1 11.4,32.64 arc-45 R19.1 11.64,31.8 arc45 11.73,31.57 v12.29,31.01
  Top 0.406: U$3.4 11.36,15.66 11.36,21.13 v13.34,23.11
  Bottom 0.406: v13.34,23.11 13.34,29.97 v12.29,31.01
IBP  (via drill 0.4)
  Top 0.254: v13.33,21.05 U$3.3 | R25.1 7.2,33.35 arc45 7.42,33.25 R20.2 8.26,32.12 v8.59,31.79
  Bottom 0.254: v8.59,31.79 8.59,25.79 v13.33,21.05
LNV1  (via drill 0.4)
  Top 0.406: v20.17,17.93 20.17,19.16 R4.1
  Bottom 0.406: U$3.5 12.39,12.57 20.37,12.57 22.68,14.88 22.68,16.55 21.31,17.93 v20.17,17.93
LNV2  (via drill 0.4)
  Top 0.406: 24.59,19.91 24.57,19.92 R13.1 24.59,19.81 v26.75,19.81
  Bottom 0.406: U$3.6 11.79,11.17 21.03,11.17 26.75,16.88 v26.75,19.81
MPLEX  (via drill 0.4)
  Top 0.254: U1.6 21.25,23.06 21.58,23.06 21.92,23.41 21.92,25.47 22.33,25.88 22.87,25.88 22.94,25.95 v23.07,25.95 | U3.12 30.95,44.94 v32.06,43.83 | v32,32.68 30.18,32.68 29.39,31.9 v29.39,31.85
  Bottom 0.254: v23.07,25.95 29.24,31.85 v29.39,31.85 | v32.06,43.83 32.03,43.81 32.03,32.71 v32,32.68
N$1
  Top 0.254: U2.19 16.1,39.4 16.14,39.44 17.31,39.44 17.93,40.06 17.93,42.08 13.49,46.52 | 13.49,46.52 XTAL.1 | 13.49,46.52 12.5,47.52 C7.2
N$2
  Top 0.254: XTAL.2 17.73,46.52 | 17.73,46.52 16.67,46.52 C8.2 | 17.73,46.52 18.49,45.76 18.49,39.95 17.44,38.9 U2.18
N$3  (via drill 0.4)
  Top 0.254: 13.06,29.61 arc45 13.13,29.43 R23.1 | U2.11 12.48,35.44 13.86,34.07 13.86,34 13.89,33.96 13.89,31.79 | R23.1 13.89,29.64 13.89,31.79 | R23.1 | R23.1 13.41,29.38 | v14.86,30.83 13.89,31.79 | C20.1 13.39,29.17 R23.1 | U1.4 21.03,25.35 v20.24,26.13
  Bottom 0.254: v14.86,30.83 15.55,30.83 v20.24,26.13
N$4
  Top 0.254: 30.63,15.27 U$4.6
  Top 0.406: U$4.6 29.74,15.36 29.36,15.74 25.91,15.74 R36.2
N$5
  Top 0.254: U2.9 11.48,35.91 arc-45 11.41,35.73 9.81,35.73 arc45 9.59,35.64 9.04,35.1 7.42,35.1 6.11,33.79 arc45 6.04,33.61 R25.2 6.04,32.35 arc-45 C4.2 arc-45 C4.2 R21.2
N$7  (1 unrouted)
  Top 0.254: C11.1 C10.1 15.01,34.55 14.65,34.91 14.64,34.91 13.81,35.74 13.7,35.74 13.48,35.95
N$8
  Top 0.254: C12.2 arc45 18.91,34.3 C13.2 17.87,35.06 15.53,37.4 U2.15
N$10
  Top 0.254: U1.1 22.27,23.03 20.83,21.59 R4.2 19.03,21.32 R43.1
N$11
  Top 0.254: U2.10 11.98,35.23 arc-45 11.89,35.01 11.74,34.86 arc45 11.65,34.63 C14.1 10.78,33.78 arc45 R18.2 10.65,33.7 10.11,33.7 9.91,33.5 9.91,31.92 10.19,31.64 R24.1
N$12
  Top 0.254: U2.3 7.97,39.4 6.48,40.89 5.16,40.89 4.33,41.71 C16.2 4.33,43.39 C15.2
N$13
  Top 0.254: U1.3 25.33,24.93 26.9,23.36 26.9,22.75 25.52,21.37 R13.2 24.4,21.32 R44.2
N$14
  Top 0.254: R40.1 32.82,6.79 32.82,11.59 35.32,14.09 U$4.2
N$15
  Top 0.254: 32.34,12.38 32.24,12.29 | 32.34,12.38 32.34,9.93 C26.2 | 32.34,12.38 35.32,15.36 U$4.3
N$17  (via drill 0.4)
  Top 0.254: C26.1 28.54,10.36 v28.5,10.36
  Top 0.406: R34.2 22.82,13.33 v24.17,11.98
  Bottom 0.406: v24.17,11.98 25.8,10.36 v28.5,10.36
N$18
  Top 0.813: 47.35,15.36 L1.P$2 47.61,15.11 42.7,15.11 40.82,13.23 D3.N 38.21,12.82 U$4.1 36.39,12.35 C25.2
N$19
  Top 0.254: 36.98,16.63 U$4.4 35.28,16.63 30.19,21.72 R37.1 28.56,21.72
  Top 0.406: 28.56,21.72 28.62,21.66 R35.2
N$20
  Top 0.254: Q2.3 43.77,1.45 | 43.77,1.45 43.68,1.36 | 43.77,1.45 28.37,1.45 R39.1
N$21
  Top 0.254: 44.12,25.15 BLUE_LED.K 41.76,25.15 R33.2
N$22  (via drill 0.4)
  Top 0.254: 30.97,12.57 U$4.8
  Top 0.61: C25.1 35.8,9.74 v34.49,11.04 | U$4.8 v30.72,11.07 v30.72,11.06
  Bottom 0.254: 34.47,11.06 v34.49,11.04
  Bottom 0.61: v30.72,11.06 34.47,11.06
N$23
  Top 0.406: R9.2 4.28,47.9 4.28,48.73 | U$2.5 3.15,49.86 4.28,48.73 | R11.2 4.36,48.73 4.28,48.73
N$24
  Top 0.254: U2.5 9.09,38.4 8.28,37.58 arc-45 8.1,37.5 7.01,37.5 R26.2 6.01,37.49 arc-45 C17.2 arc-45 5.92,37.49 5.91,37.49 R28.2
N$25
  Top 0.254: R/G_LED.CX 42.62,12.61 40.26,10.25 R41.2
N$26
  Top 0.254: R/G_LED.CR 44.49,7.5 | 44.49,7.5 44.12,7.12 | R42.2 41.03,7.5 44.49,7.5
N$27
  Top 0.254: 9.81,37.9 U2.6 9.43,37.9 7.72,36.19 7.72,35.99 7.44,35.71 6.22,35.71 5.11,34.59 5.11,32.57 arc-45 5.03,32.39 C18.1 arc-45 5.01,32.25 R17.1 arc-45 5.02,31.23 R27.2
N$28
  Top 0.254: R10.1 9.44,55.93 10.92,57.41 U$1.3
N$29
  Top 0.406: U$2.2 3.18,52.34 3.18,52.78 4.64,54.23 R10.2 R12.2
N$30  (via drill 0.4)
  other vias: 32.66,16.45
N$31  (via drill 0.4)
  other vias: 33.88,16.48
N$32  (via drill 0.4)
  Top 0.406: v10.29,54.83 10.29,51.22 9.47,50.4 R11.1 | U$1.6 8.42,59.64 7.93,59.14 v7.93,57.98
  Bottom 0.406: v10.29,54.83 9.3,54.83 7.93,56.2 v7.93,57.98
N$33
  Top 0.254: U$2.6 3.8,51.01 3.13,51.68 2.8,51.68 2.61,51.87 2.61,52.2 U$2.3
  Top 0.406: U$2.3 2.5,52.68 1.94,53.24 1.94,54.99 R8.1
N$34  (via drill 0.4)
  other vias: 32.66,15.34
N$35  (via drill 0.4)
  other vias: 33.91,15.34
N$36  (via drill 0.4)
  other vias: 32.66,14.04
N$38
  Top 0.254: R39.2 24.57,3.21 22.96,1.6 3.52,1.6 2.13,2.99 U$5.1
N$40
  Top 0.254: J1.3 34.04,55.87 R14.2
N$62
  Top 0.254: R5.1 32.75,61.67 J1.2
N$65
  Top 0.254: R7.1 36.61,61.68 J1.8
NRST  (via drill 0.4)
  Top 0.254: R5.2 32.78,64.68 R6.1 33.75,67.34 36.77,67.34 C3.2 39.52,64.59 v39.52,64.56 39.52,64.61 | v37.85,53.33 37.85,49.85 38.3,49.4 38.3,48.43 38.66,48.08 41.48,48.08 42.38,47.17 U3.3
  Bottom 0.254: v39.52,64.56 37.82,62.86 v37.85,53.33
PILOT  (via drill 0.4)
  Top 0.406: 4.96,58.43 5.02,58.43
  Top 0.61: 5.02,58.43 4.4,57.82 4.4,55.33 3.35,54.28 R8.2 | v4.01,59.38 4.96,58.43 8.41,61.89 D1.N 13.8,65.11 R3.2
  Bottom 0.254: 3.13,15.83 U$3.8
  Bottom 0.406: 3.27,15.69 U$3.8 | U$3.8 | v4.01,59.38 4.01,44.49 3.33,43.81 U$3.8
PILOT_GEN
  Top 0.254: U$1.5 10.27,58.67 | 10.27,58.67 U$1.2 | 10.27,58.67 12.27,58.67 R1.2 14.56,56.38 19.22,56.38 27.4,48.2 32.85,48.2 33.49,47.56 U3.10 33.49,46.57
PILOT_READ  (via drill 0.4)
  Top 0.254: R2.2 19.43,62.5 | D2.1 27.09,59.35 v29.72,59.35 | v34.72,49.17 36.37,47.52 39.12,47.52 39.84,46.79 U3.5
  Top 0.406: D2.1 23.07,63.41 R3.1 21.55,63.55 20.48,63.55
  Top 0.61: 20.48,63.55 R2.2
  Bottom 0.254: v29.72,59.35 31.29,57.78 31.29,54.73 34.72,51.3 v34.72,49.17
RED_LED  (via drill 0.4)
  Top 0.254: v38.42,5.15 38.77,5.49 R42.1 | v32.74,25.27 30.95,27.06 U3.27
  Bottom 0.254: v38.42,5.15 39.5,6.66 39.5,22.37 38.36,23.51 34.34,23.51 32.74,25.11 v32.74,25.27
RELAY1  (via drill 0.4)
  Top 0.254: 36.03,45.77 36.03,46.02 | 36.03,46.02 U3.8 36.03,45.35 37.97,43.4 39.5,43.4 41.35,41.55 v41.35,40.43 | v7.01,6.68 4.13,3.8 U$5.2 | 36.3,45.75 36.03,46.02
  Bottom 0.254: v7.01,6.68 7.22,6.89 12.81,6.89 17.78,1.92 38.23,1.92 40.23,3.93 40.23,25.06 | 40.23,25.06 40.23,25.27 40.31,25.34 | 40.23,25.06 42.77,27.6 42.77,39.01 v41.35,40.43
RELAY2  (via drill 0.4)
  Top 0.254: U3.9 34.76,45.77 37.87,42.67 39.09,42.67 v40.31,41.45 | v8.08,5.66 6.13,3.71 U$5.3
  Bottom 0.254: v8.08,5.66 12.74,5.66 17.13,1.27 38.64,1.27 40.96,3.59 40.96,24.24 43.63,26.91 43.63,39.28 41.46,41.45 v40.31,41.45
RELAY_EN  (via drill 0.4)
  Top 0.254: v53.04,8.76 52.15,9.65 Q2.1 | v42.01,22.63 40.01,22.63 38.15,24.48 38.15,26.26 38.61,26.71 38.57,26.75 U3.33
  Bottom 0.254: v53.04,8.76 53.43,9.15 53.43,12.48 45.2,20.71 42.33,20.71 41.63,21.41 41.63,22.24 v42.01,22.63
RESET_ISO  (via drill 0.4)
  Top 0.254: v28.96,44.24 28.41,44.79 U3.14 | v5.74,41.8 6.53,41.8 8.41,39.92 10.06,39.92 U2.2
  Bottom 0.254: 24.83,47.66 24.77,47.72 10.21,47.72 5.74,43.25 v5.74,41.8 | 24.83,47.66 24.84,47.64 | 24.83,47.66 25.54,47.66 v28.96,44.24
REVP  (via drill 0.35)
  Top 0.254: U2.20 16.76,39.9 v17.22,40.35
RXD0  (via drill 0.4)
  Top 0.254: 39.89,28.17 39.89,28.4 39.84,28.35 U3.34 39.84,29.52 37.92,31.44 v37.67,31.44 | v35.22,63.85 36.05,64.68 R7.2
  Bottom 0.254: v35.22,63.85 35.96,63.11 35.96,55.58 36.07,55.47 36.07,34.66 36.07,34.63 36.07,33.04 v37.67,31.44
SCL  (2 unrouted)
SDA  (3 unrouted)
SPIMISO  (via drill 0.4)
  Top 0.254: 12,41.32 U2.26 11.98,42.14 11.02,43.1 v10.64,43.1 | v29.13,36.11 30.79,36.11 36.09,30.8 36.09,28.23 U3.31
  Bottom 0.254: v29.13,36.11 29.06,36.19 27.25,36.19 20.45,43 18.16,43 16.28,44.88 12.27,44.8 10.69,43.22 v10.64,43.1
SPIMOSI  (via drill 0.4)
  Top 0.254: 43.65,27.77 U3.37 43.65,29.57 40.36,32.86 34.9,32.86 33.6,34.16 33.6,35.5 31.01,38.09 v29.11,38.09 | U2.27 11.46,41.32 11.46,41.86 11.27,42.05 9.86,42.05 v8.81,43.1
  Bottom 0.254: v29.11,38.09 26.54,38.09 21.13,43.5 19.08,43.5 16.92,45.66 11.38,45.66 v8.81,43.1
SPISCLK  (via drill 0.4)
  Top 0.254: 12.5,41.32 U2.25 v12.48,43.11 v12.47,43.12 | v29.16,34.06 31.85,34.06 34.8,31.11 34.8,28.21 U3.30
  Bottom 0.254: v29.16,34.06 28.32,34.06 19.92,42.46 18.52,42.46 18.5,42.44 17.7,42.44 15.9,44.24 13.59,44.24 v12.47,43.12
TXD0  (via drill 0.4)
  Top 0.254: v36.67,55.87 36.67,58 J1.7 | U3.35 41.11,29.98 v39.68,31.41
  Bottom 0.254: v39.68,31.41 36.67,34.42 36.67,35.91 v36.67,55.87
V2P
  Top 0.254: U2.12 13.01,36.47 | U2.12 arc-45 13.01,36.44 | R31.1 C19.1 16.22,31.06 arc-45 16,31.15 14.46,32.68 arc-45 14.39,32.86 14.39,34.27 arc45 14.31,34.45 12.98,35.78 U2.12
ZX  (via drill 0.35)
  Top 0.254: U2.1 9.28,40.4 8.59,41.09 v8.53,41.09
ZX_I  (via drill 0.35)
  Top 0.254: U2.21 15.71,40.4 v16.1,40.79

### Text on the board
tPlace: MOSI | MISO | CLK | CS | CF2 | CF1
tNames: ESP32 Based EVSE Controller ver 1.0 | Modified from Smartenit / EVSE Controller